# Altium schematic sheet BUTTONS.SchDoc: =DocumentName
size B
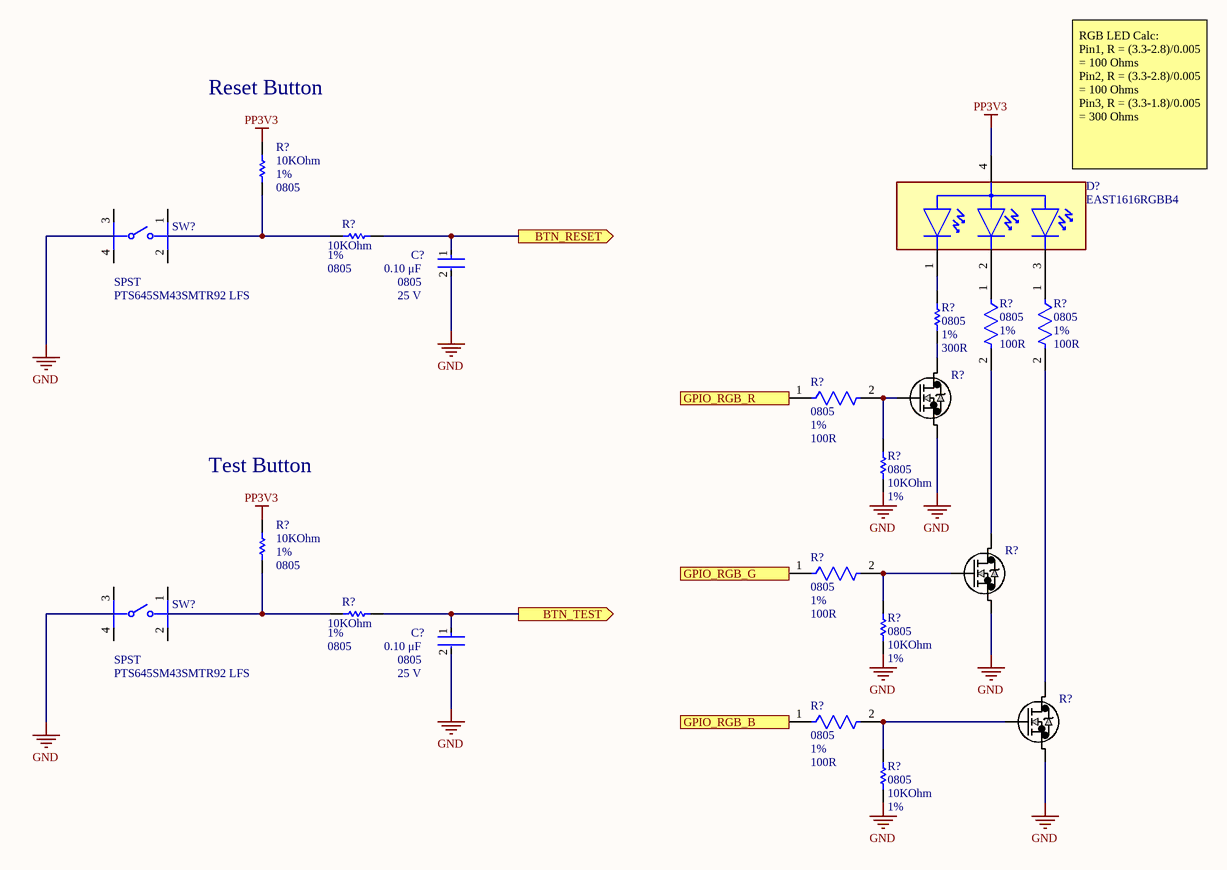
[diagram p0: BUTTONS.SchDoc]

## Parts
(Parts that share a designator on the sheet are numbered #1, #2 ... from top to bottom, then left to right.)
C?#1  Capacitance: 0.10 μF  Package: 0805  Voltage Rating: 25 V  [FP-C0805C-DN-MFG]  (hidden comment: C0805C104M3RACTU)
C?#2  Capacitance: 0.10 μF  Package: 0805  Voltage Rating: 25 V  [FP-C0805C-DN-MFG]  (hidden comment: C0805C104M3RACTU)
D?  EAST1616RGBB4  [FP-EAST1616RGBB4-MFG]
R?#1  value 10KOhm  PackageReference: 0805  Tolerance: 1%  [RESC2013X60X35NL10T20]  (hidden comment: RC0805FR-0710KL)
R?#2  value 10KOhm  Package Reference: 0805  Tolerance: 1%  [RESC2013X50X30NL20T20]  (hidden comment: CRCW080515K0FKTA)
R?#3  Case Code (Imperial): 0805  Tolerance: 1%  Resistance: 100R  [FP-RMCF0805-IPC_A]  (hidden comment: RMCF0805FT100R)
R?#4  Case Code (Imperial): 0805  Tolerance: 1%  Resistance: 100R  [FP-RMCF0805-IPC_A]  (hidden comment: RMCF0805FT100R)
R?#5  PackageReference: 0805  Tolerance: 1%  Resistance: 300R  [RESC2013X70X40LL20T20]  (hidden comment: ERJ-6ENF3000V)
R?#6  Case Code (Imperial): 0805  Tolerance: 1%  Resistance: 100R  [FP-RMCF0805-IPC_A]  (hidden comment: RMCF0805FT100R)
R?#7  RK7002BMT116  [TRANS_RK7002BMHZG_ROM]  (value not drawn)
R?#8  value 10KOhm  Package Reference: 0805  Tolerance: 1%  [RESC2013X50X30NL20T20]  (hidden comment: CRCW080515K0FKTA)
R?#9  value 10KOhm  PackageReference: 0805  Tolerance: 1%  [RESC2013X60X35NL10T20]  (hidden comment: RC0805FR-0710KL)
R?#10  Case Code (Imperial): 0805  Tolerance: 1%  Resistance: 100R  [FP-RMCF0805-IPC_A]  (hidden comment: RMCF0805FT100R)
R?#11  RK7002BMT116  [TRANS_RK7002BMHZG_ROM]  (value not drawn)
R?#12  value 10KOhm  Package Reference: 0805  Tolerance: 1%  [RESC2013X50X30NL20T20]  (hidden comment: CRCW080515K0FKTA)
R?#13  value 10KOhm  Package Reference: 0805  Tolerance: 1%  [RESC2013X50X30NL20T20]  (hidden comment: CRCW080515K0FKTA)
R?#14  Case Code (Imperial): 0805  Tolerance: 1%  Resistance: 100R  [FP-RMCF0805-IPC_A]  (hidden comment: RMCF0805FT100R)
R?#15  RK7002BMT116  [TRANS_RK7002BMHZG_ROM]  (value not drawn)
R?#16  value 10KOhm  Package Reference: 0805  Tolerance: 1%  [RESC2013X50X30NL20T20]  (hidden comment: CRCW080515K0FKTA)
SW?#1  Throw Configuration: SPST  Manufacturer Part Number: PTS645SM43SMTR92 LFS  [FP-PTS645SM43SMTR92LFS-MFG]  (hidden comment: PTS645SM43SMTR92LFS)
SW?#2  Throw Configuration: SPST  Manufacturer Part Number: PTS645SM43SMTR92 LFS  [FP-PTS645SM43SMTR92LFS-MFG]  (hidden comment: PTS645SM43SMTR92LFS)

## Ports
BTN_RESET (out), BTN_TEST (out), GPIO_RGB_B (in), GPIO_RGB_G (in), GPIO_RGB_R (in)

## Nets
GND: C?#1.2 C?#2.2 R?#7.3 R?#8.1 R?#11.3 R?#13.1 R?#15.3 R?#16.1
PP3V3: D?.4(COMMON_ANODE) R?#1.2 R?#9.2
BTN_RESET: C?#1.1 R?#2.2 ; port BTN_RESET
BTN_TEST: C?#2.1 R?#12.2 ; port BTN_TEST
GPIO_RGB_B: R?#14.1 ; port GPIO_RGB_B
GPIO_RGB_G: R?#10.1 ; port GPIO_RGB_G
GPIO_RGB_R: R?#6.1 ; port GPIO_RGB_R
NetD?_1: D?.1(RED_C) R?#5.1
NetD?_2: D?.2(GREEN_C) R?#3.1
NetD?_3: D?.3(BLUE_C) R?#4.1
NetR?#1_1: R?#1.1 R?#2.1
NetR?#3_2: R?#3.2 R?#11.1
NetR?#4_2: R?#4.2 R?#15.1
NetR?#5_2: R?#5.2 R?#7.1
NetR?#6_2: R?#6.2 R?#7.2 R?#8.2
NetR?#9_1: R?#9.1 R?#12.1
NetR?#10_2: R?#10.2 R?#11.2 R?#13.2
NetR?#14_2: R?#14.2 R?#15.2 R?#16.2

Not connected (* = marked no-connect by the designer): SW?#1 1 2 3 4; SW?#2 1 2 3 4

## Notes on the sheet
- Reset Button
- (near D?) RGB LED Calc:
  Pin1, R = (3.3-2.8)/0.005 = 100 Ohms
  Pin2, R = (3.3-2.8)/0.005 = 100 Ohms
  Pin3, R = (3.3-1.8)/0.005 = 300 Ohms
- Test Button
- Title
- Size:
- Date:
- B
- Number:
- Time:
- Revision:
- Sheet
- of
- File:

## Library data of the parts
C?#1 C?#2 = CMP-2007-00282-2: CAP CER 0.1UF 25V 20% X7R 0805; Manufacturer: KEMET; Temperature Coefficient: 30ppm/°C; Material: Ceramic; Tolerance: 0.2; Value: 0.10 μF; Digikey Description: CAP CER 0.1UF 25V 20% X7R 0805; Device Class L2: Capacitors; Temperature: -55°C to +125°C; Device Class L1: Passive Components; ComponentLink2Description: Datasheet; Mouser Description: Multilayer Ceramic Capacitors MLCC - SMD/SMT 25volts 0.1uF X7R 20%; Temperature Range High: +125°C; Device Class L3: Ceramic Capacitors; Automotive: No; Temperature Range Low: -55°C; RoHS: TRUE; Category: Cap; Lead Free: Yes; Ipc Land Pattern Name: CAPC200125X78; Height: 0.88mm; Temperature Characteristic: X7R; Octopart: https://octopart.com/c0805c104m3ractu-kemet-9138612; ComponentLink2URL: https://content.kemet.com/datasheets/KEM_C1003_C0G_SMD.pdf; Manufacturer Part Number: C0805C104M3RACTU; Supplier: Digi-Key; Supplier Part Number: 399-C0805C104M3RAC7800CT-ND
D? = CMP-51564-000009-1: LED RGB CLEAR 4SMD; Manufacturer: Everlight Electronics Co Ltd; Element Configuration: Common Anode; Test Current: 5mA; Lens Color: Colorless; Lens Size: 1.1mm; Viewing Angle: 120°; Color: Blue; Lens Style: Flat; Forward Voltage: 2.8V; Mount: Surface Mount; Length: 1.6mm; Packaging: Tape and Reel; Case/Package: 0606; Lens Transparency: Clear; Case Code (Metric): 1616; Width: 1.6mm; Height: 0.45mm; Case Code (Imperial): 0606; Manufacturer Part Number: EAST1616RGBB4; Supplier: Digi-Key; Supplier Part Number: 1080-1552-1-ND
R?#1 R?#9 = CMP-1659-00013-4: Chip Resistor, 10 KOhm, +/- 1%, 0.125 W, -55 to 155 degC, 0805 (2012 Metric), RoHS, Tape and Reel; Manufacturer: Yageo; Voltage Rating: 150 V; Mount: Surface Mount; ComponentLink1Description: Manufacturer URL; ComponentLink2URL: http://www.yageo.com/documents/recent/PYu-RC_Group_51_RoHS_L_04.pdf; Pins: 2; Length: 2 mm; Min Operating Temperature: -55 degC; Height: 0.5 mm; Mounting Technology: Surface Mount; RoHSCompliant: true; REACH SVHC: No SVHC; ComponentLink1URL: http://www.yageo.com/; Max Operating Temperature: 155 degC; DatasheetVersion: Rev. 4, 02/2016; Package Quantity: 5000; Packaging: Tape and Reel; ComponentLink2Description: Datasheet; PackageDescription: 2-Pin Surface Mounted Device, Body 2 x 1.25 mm; Manufacturer Part Number: RC0805FR-0710KL; Supplier: Digi-Key; Supplier Part Number: RC0805FR-0710KL
R?#2 R?#8 R?#12 R?#13 R?#16 = CMP-2001-04968-1: Manufacturer: Vishay Dale; Manufacturer Part Number: CRCW080515K0FKTA; Supplier: Digi-Key; Supplier Part Number: 541-3019-1-ND
R?#3 R?#4 R?#6 R?#10 R?#14 = CMP-26527-001731-1: 100Ω ±1% 0.125W 0805 Thick Film Chip Resistor AEC-Q200 compliant; Manufacturer: Stackpole Electronics Inc; Power Rating: 250mW; Temperature Coefficient: 100ppm/°C; Max Power Dissipation: 125mW; Radiation Hardening: No; RoHS Compliant: Yes; Depth: 1.25mm; Length: 2mm; Min Operating Temperature: -55°C; Series: RMCF; Packaging: Tape and Reel; Features: Automotive AEC-Q200; Height: 0.026inch; Size Code: 0805; Number of Terminations: 2; Max Operating Temperature: 155°C; Case/Package: 0805; Width: 0.049inch; Contact Plating: Tin; Resistor Type: Thick Film; Construction: Rectangular; Lead Free: Lead Free; Military Standard: Not; Case Code (Metric): 2012; Mount: Surface Mount; Manufacturer Part Number: RMCF0805FT100R; Supplier: Digi-Key; Supplier Part Number: RMCF0805FT100RCT-ND
R?#5 = CMP-2001-00110-5: Chip Resistor, 300 Ohm, +/- 1%, 0.125 W, -55 to 155 degC, 0805 (2012 Metric), RoHS, Tape and Reel; Manufacturer: Panasonic; Voltage Rating: 150 V; Package Quantity: 5000; PackageDescription: 2-Pin Surface Mount Device, Body 2 x 1.25 mm; Mounting Technology: Surface Mount; ComponentLink2URL: http://industrial.panasonic.com/cdbs/www-data/pdf/RDA0000/AOA0000C86.pdf; DatasheetVersion: 04/2015; ComponentLink1URL: http://www.panasonic.com/; Mount: Surface Mount; ComponentLink1Description: Manufacturer URL; RoHSCompliant: true; Min Operating Temperature: -55 degC; Height: 0.6 mm; ComponentLink2Description: Datasheet; Max Operating Temperature: 155 degC; Length: 2 mm; Packaging: Tape and Reel; REACH SVHC: Yes; Manufacturer Part Number: ERJ-6ENF3000V; Supplier: Digi-Key; Supplier Part Number: P300CCT-ND
R?#7 R?#11 R?#15 = RK7002BMT116: No Description Available; Manufacturer: Rohm Semiconductor; Copyright: Copyright (C) 2022 Ultra Librarian. All rights reserved.; Manufacturer Part Number: RK7002BMT116; Digi-Key_Part_Number_1: RK7002BMT116CT-ND; Digi-Key_Part_Number_2: RK7002BMT116DKR-ND; Digi-Key_Part_Number_3: RK7002BMT116TR-ND; RefDes: RefDes; Type: DEV; Supplier: Digi-Key; Supplier Part Number: RK7002BMT116CT-ND
SW?#1 SW?#2 = CMP-2000-05160-2: SWITCH TACTILE SPST-NO 0.05A 12V; Manufacturer: C&K; Contact Resistance: 100mR; Illumination Type: Non-Illuminated; Mechanical Life: 100000Cycles; Current Rating: 50mA; Switch Function: Off-Mom; Actuator Length: 0.85mm; Actuator Material: Nylon; Actuator Type: Standard; Operating Force: 160gf; Min Operating Temperature: -20°C; REACH SVHC: No SVHC; Termination: Gull Wing; Case/Package: SMD/SMT; Packaging: Tape and Reel; Mount: Surface Mount; Voltage Rating (DC): 12V; Orientation: Straight; Lead Free: Lead Free; Contact Material: Silver; Color: Black; Max Current Rating: 50mA; Contact Plating: Silver; Depth: 9mm; Package Quantity: 1; Max Voltage Rating (DC): 12V; Length: 6mm; Max Operating Temperature: 60°C; Supplier: Digi-Key; Supplier Part Number: CKN9112CT-ND